# Altium schematic sheet MCU.SchDoc
size A4; SheetNumber: 2; SheetTotal: 4
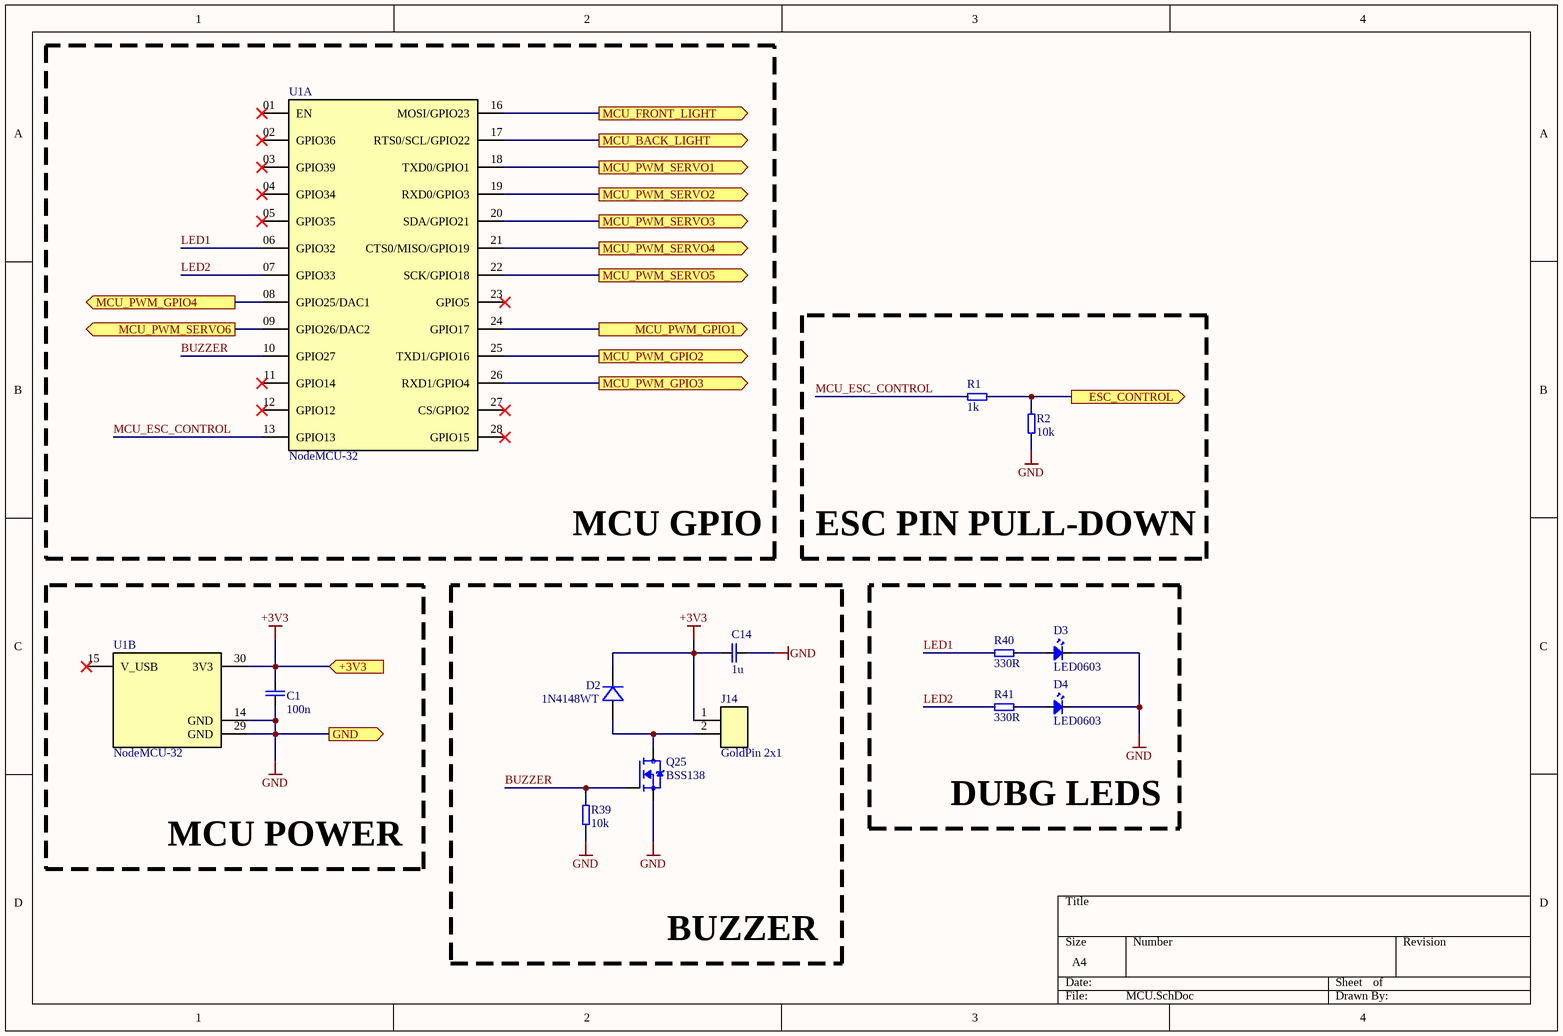
[diagram p0: MCU.SchDoc]

## Parts
C1  100n  [C0402]
C14  1u  [C0603]
D2  1N4148WT  [SMBJSeries_LTF]
D3  LED0603  [LED0603]
D4  LED0603  [LED0603]
J14  GoldPin 2x1  [HARWIN_M20-9990246]
Q25  BSS138  [SOT95P240X111-3N]
R1  1k  [R0402]
R2  10k  [R0402]
R39  10k  [R0603]
R40  330R  [R0603]
R41  330R  [R0603]
U1  NodeMCU-32  [NodeMCU-32]  (parts A,B of 2)

## Blocks framed on the sheet
MCU GPIO: U1
ESC PIN PULL-DOWN: R1 R2
MCU POWER: C1 U1
BUZZER: C14 D2 J14 Q25 R39
DUBG LEDS: D3 D4 R40 R41

## Ports
+3V3 (in, see Tractor2000[4B], POWER[4A]), ESC_CONTROL (out, see Tractor2000[4C]), GND (out, see Tractor2000[4C], LOAD_SWITCHES[2A], POWER[1A]), MCU_BACK_LIGHT (out, see Tractor2000[4B], LOAD_SWITCHES[1B]), MCU_FRONT_LIGHT (out, see Tractor2000[4B], LOAD_SWITCHES[1A]), MCU_PWM_GPIO1 (out, see Tractor2000[4B], LOAD_SWITCHES[3A]), MCU_PWM_GPIO2 (out, see Tractor2000[4B], LOAD_SWITCHES[3B]), MCU_PWM_GPIO3 (out, see Tractor2000[4B], LOAD_SWITCHES[5A]), MCU_PWM_GPIO4 (out, see Tractor2000[4B], LOAD_SWITCHES[5B]), MCU_PWM_SERVO1 (out, see Tractor2000[4B], LOAD_SWITCHES[1C]), MCU_PWM_SERVO2 (out, see Tractor2000[4B], LOAD_SWITCHES[1D]), MCU_PWM_SERVO3 (out, see Tractor2000[4B], LOAD_SWITCHES[3C]), MCU_PWM_SERVO4 (out, see Tractor2000[4B], LOAD_SWITCHES[3D]), MCU_PWM_SERVO5 (out, see Tractor2000[4B], LOAD_SWITCHES[5C]), MCU_PWM_SERVO6 (out, see Tractor2000[4B], LOAD_SWITCHES[5D])

## Nets
+3V3: C1.2 C14.2 D2.1 J14.1 U1.30(3V3) ; port +3V3
GND: C1.1 C14.1 D3.K D4.K Q25.2(S) R2.1 R39.1 U1.14(GND) U1.29(GND) ; port GND
BUZZER: Q25.1(G) R39.2 U1.10(GPIO27)
ESC_CONTROL: R1.2 R2.2 ; port ESC_CONTROL
LED1: R40.2 U1.06(GPIO32)
LED2: R41.2 U1.07(GPIO33)
MCU_BACK_LIGHT: U1.17(RTS0/SCL/GPIO22) ; port MCU_BACK_LIGHT
MCU_ESC_CONTROL: R1.1 U1.13(GPIO13)
MCU_FRONT_LIGHT: U1.16(MOSI/GPIO23) ; port MCU_FRONT_LIGHT
MCU_PWM_GPIO1: U1.24(GPIO17) ; port MCU_PWM_GPIO1
MCU_PWM_GPIO2: U1.25(TXD1/GPIO16) ; port MCU_PWM_GPIO2
MCU_PWM_GPIO3: U1.26(RXD1/GPIO4) ; port MCU_PWM_GPIO3
MCU_PWM_GPIO4: U1.08(GPIO25/DAC1) ; port MCU_PWM_GPIO4
MCU_PWM_SERVO1: U1.18(TXD0/GPIO1) ; port MCU_PWM_SERVO1
MCU_PWM_SERVO2: U1.19(RXD0/GPIO3) ; port MCU_PWM_SERVO2
MCU_PWM_SERVO3: U1.20(SDA/GPIO21) ; port MCU_PWM_SERVO3
MCU_PWM_SERVO4: U1.21(CTS0/MISO/GPIO19) ; port MCU_PWM_SERVO4
MCU_PWM_SERVO5: U1.22(SCK/GPIO18) ; port MCU_PWM_SERVO5
MCU_PWM_SERVO6: U1.09(GPIO26/DAC2) ; port MCU_PWM_SERVO6
NetD2_2: D2.2 J14.2 Q25.3(D)
NetD3_A: D3.A R40.1
NetD4_A: D4.A R41.1

Not connected (* = marked no-connect by the designer): U1 01(EN)* 02(GPIO36)* 03(GPIO39)* 04(GPIO34)* 05(GPIO35)* 11(GPIO14)* 12(GPIO12)* 15(V_USB)* 23(GPIO5)* 27(CS/GPIO2)* 28(GPIO15)*

## Library data of the parts
C1 = CMP-00023-15: Generic SMD 0402 Ceramic Capacitor
C14 = CMP-00024-8: Generic 0603 SMD Ceramic Capacitor
D2 = 1N4148WT: Description; Manufacturer_Name: Littelfuse Inc; Manufacturer_Part_Number: SMBJ7.0A; Copyright: Copyright (C) 2025 Ultra Librarian. All rights reserved.
D3 D4 = CMP-00036-7: 0603 LED
J14 = GoldPin 2x1: 2.54mm (0.1) Pitch SIL Vertical Throughboard Pin Header, 6.1mm mating pin height, tin, 2 contacts; MF: Harwin; MP: M20-9990246; SnapEDA_Link: https://www.snapeda.com/parts/M20-9990246/Harwin/view-part/?ref=snap; Package: None; Value: *; Check_prices: https://www.snapeda.com/parts/M20-9990246/Harwin/view-part/?ref=eda
Q25 = BSS138: N-Channel 50 V 220mA (Ta) 350mW (Ta) Surface Mount SOT-23-3; MF: onsemi; SnapEDA_Link: https://www.snapeda.com/parts/BSS138/Onsemi/view-part/?ref=snap; Package: SOT-23-3 ON Semiconductor; Value: *; MP: BSS138; Check_prices: https://www.snapeda.com/parts/BSS138/Onsemi/view-part/?ref=eda
R1 R2 = CMP-00016-11: Generic 0402 SMD Resistor
R39-R41 = CMP-00017-10: Generic 0603 SMD Resistor
U1 = NodeMCU-32: MF: Samtec Inc.; MP: TS-115-T-A; Package: None; Price: None; Value: *; Availability: Unavailable